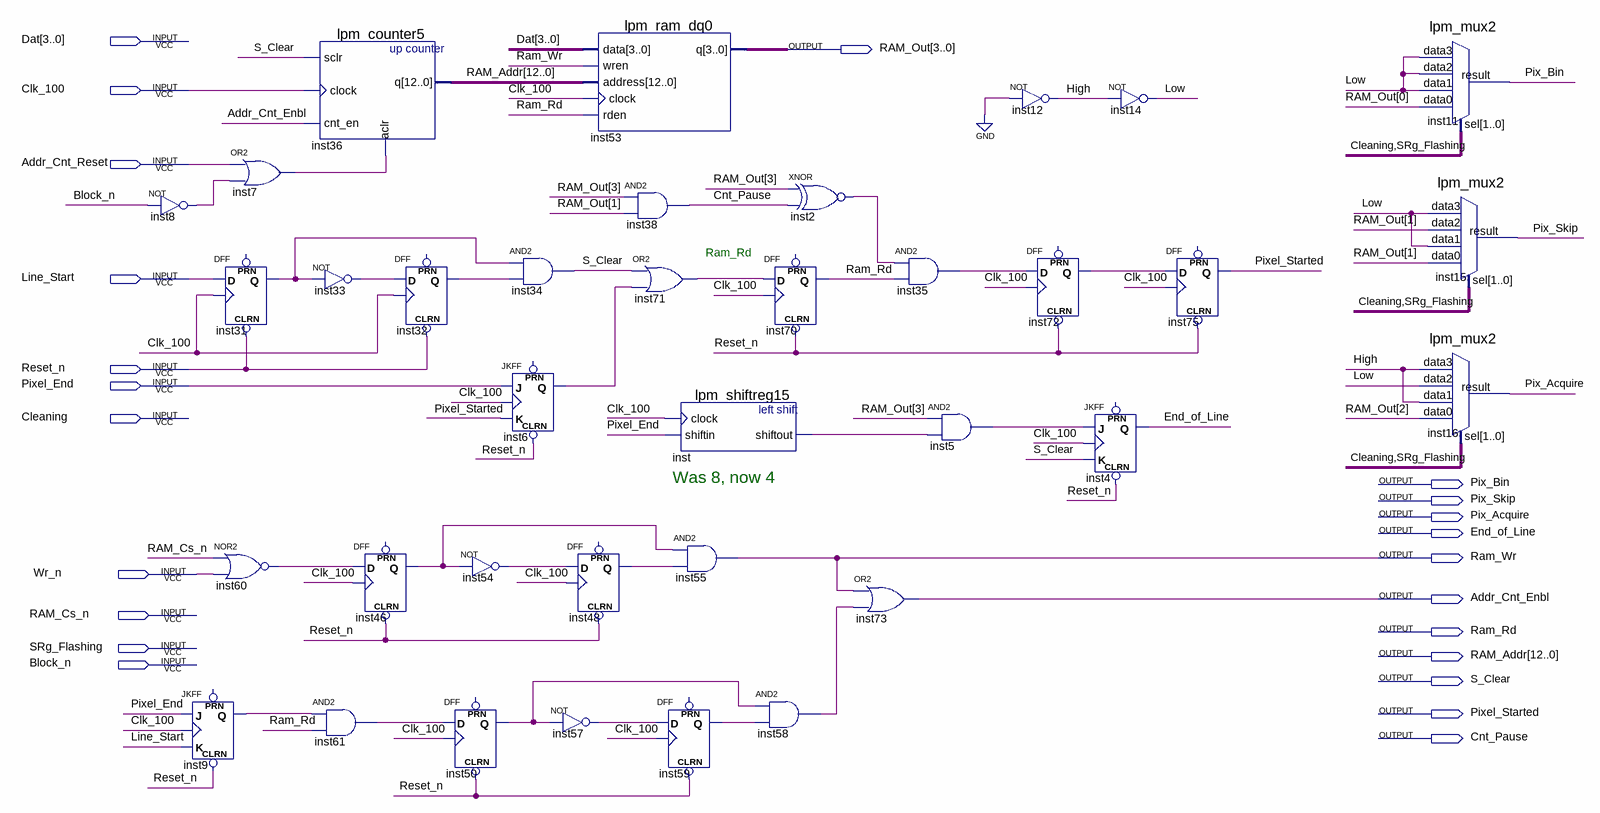
[diagram p0: schematic sheet]
// Quartus schematic Serial_Control_Module.bdf as structural Verilog: 36 symbols, 23 pins
module Serial_Control_Module (
  input  [3:0] Dat,
  input  Clk_100,
  input  Addr_Cnt_Reset,
  input  Line_Start,
  input  Reset_n,
  input  Pixel_End,
  input  Cleaning,
  input  Wr_n,
  input  RAM_Cs_n,
  input  SRg_Flashing,
  input  Block_n,
  output [3:0] RAM_Out,
  output Pix_Bin,
  output Pix_Skip,
  output Pix_Acquire,
  output End_of_Line,
  output Ram_Wr,
  output Addr_Cnt_Enbl,
  output Ram_Rd,
  output [12:0] RAM_Addr,
  output S_Clear,
  output Pixel_Started,
  output Cnt_Pause
);

  wire High, inst2_out, inst5_out, inst6_q, inst7_out, inst8_out, inst9_q, inst31_q, inst32_q, inst33_out,
       inst35_out, inst46_q, inst48_q, inst50_q, inst54_out, inst57_out, inst58_out, inst59_q, inst60_out,
       inst61_out, inst71_out, inst72_q, inst_shiftout, Low;

  not inst8 (inst8_out, Block_n);
  or inst7 (inst7_out, Addr_Cnt_Reset, inst8_out);
  DFF inst31 (.CLRN(Reset_n), .CLK(Clk_100), .D(Line_Start), .Q(inst31_q));  // open: PRN
  nor inst60 (inst60_out, RAM_Cs_n, Wr_n);
  JKFF inst9 (.CLRN(Reset_n), .K(Line_Start), .J(Pixel_End), .CLK(Clk_100), .Q(inst9_q));  // open: PRN
  lpm_counter5 inst36 (.sclr(S_Clear), .clock(Clk_100), .cnt_en(Addr_Cnt_Enbl), .aclr(inst7_out), .q(RAM_Addr));
  not inst33 (inst33_out, inst31_q);
  DFF inst46 (.CLRN(Reset_n), .CLK(Clk_100), .D(inst60_out), .Q(inst46_q));  // open: PRN
  and inst61 (inst61_out, inst9_q, Ram_Rd);
  DFF inst32 (.CLRN(Reset_n), .CLK(Clk_100), .D(inst33_out), .Q(inst32_q));  // open: PRN
  JKFF inst6 (.CLRN(Reset_n), .K(Pixel_Started), .J(Pixel_End), .CLK(Clk_100), .Q(inst6_q));  // open: PRN
  not inst54 (inst54_out, inst46_q);
  DFF inst50 (.CLRN(Reset_n), .CLK(Clk_100), .D(inst61_out), .Q(inst50_q));  // open: PRN
  and inst34 (S_Clear, inst31_q, inst32_q);
  DFF inst48 (.CLRN(Reset_n), .CLK(Clk_100), .D(inst54_out), .Q(inst48_q));  // open: PRN
  not inst57 (inst57_out, inst50_q);
  lpm_ram_dq0 inst53 (.data(Dat), .wren(Ram_Wr), .address(RAM_Addr), .clock(Clk_100), .rden(Ram_Rd), .q(RAM_Out));
  and inst38 (Cnt_Pause, RAM_Out[3], RAM_Out[1]);
  or inst71 (inst71_out, S_Clear, inst6_q);
  lpm_shiftreg15 inst (.clock(Clk_100), .shiftin(Pixel_End), .shiftout(inst_shiftout));
  and inst55 (Ram_Wr, inst46_q, inst48_q);
  DFF inst59 (.CLRN(Reset_n), .CLK(Clk_100), .D(inst57_out), .Q(inst59_q));  // open: PRN
  DFF inst70 (.CLRN(Reset_n), .CLK(Clk_100), .D(inst71_out), .Q(Ram_Rd));  // open: PRN
  and inst58 (inst58_out, inst50_q, inst59_q);
  xnor inst2 (inst2_out, RAM_Out[3], Cnt_Pause);
  and inst35 (inst35_out, inst2_out, Ram_Rd);
  or inst73 (Addr_Cnt_Enbl, Ram_Wr, inst58_out);
  and inst5 (inst5_out, RAM_Out[3], inst_shiftout);
  not inst12 (High, 1'b0);
  DFF inst72 (.CLRN(Reset_n), .CLK(Clk_100), .D(inst35_out), .Q(inst72_q));  // open: PRN
  JKFF inst4 (.CLRN(Reset_n), .K(S_Clear), .J(inst5_out), .CLK(Clk_100), .Q(End_of_Line));  // open: PRN
  not inst14 (Low, High);
  DFF inst75 (.CLRN(Reset_n), .CLK(Clk_100), .D(inst72_q), .Q(Pixel_Started));  // open: PRN
  lpm_mux2 inst11 (
    .data3(Low), .data2(Low), .data1(Low), .data0(RAM_Out[0]), .sel({Cleaning, SRg_Flashing}),
    .result(Pix_Bin));
  lpm_mux2 inst16 (
    .data3(High), .data2(Low), .data1(High), .data0(RAM_Out[2]), .sel({Cleaning, SRg_Flashing}),
    .result(Pix_Acquire));
  lpm_mux2 inst15 (
    .data3(Low), .data2(RAM_Out[1]), .data1(Low), .data0(RAM_Out[1]), .sel({Cleaning, SRg_Flashing}),
    .result(Pix_Skip));

  // Notes on the sheet:
  //   Ram_Rd
  //   Was 8, now 4
endmodule
